# Altium schematic sheet Battery.SchDoc
size A4; Engineer1: Fabian Hernandez; Engineer2: Jason Kim; Engineer3: Amirtha Chandrasekaran; Engineer4: Kevin Thai; Organization: My Company; Address1: Address Line 1; Address2: Address Line 2; Address3: Address Line 3; Address4: Address Line 4; SheetNumber: 2; SheetTotal: 3
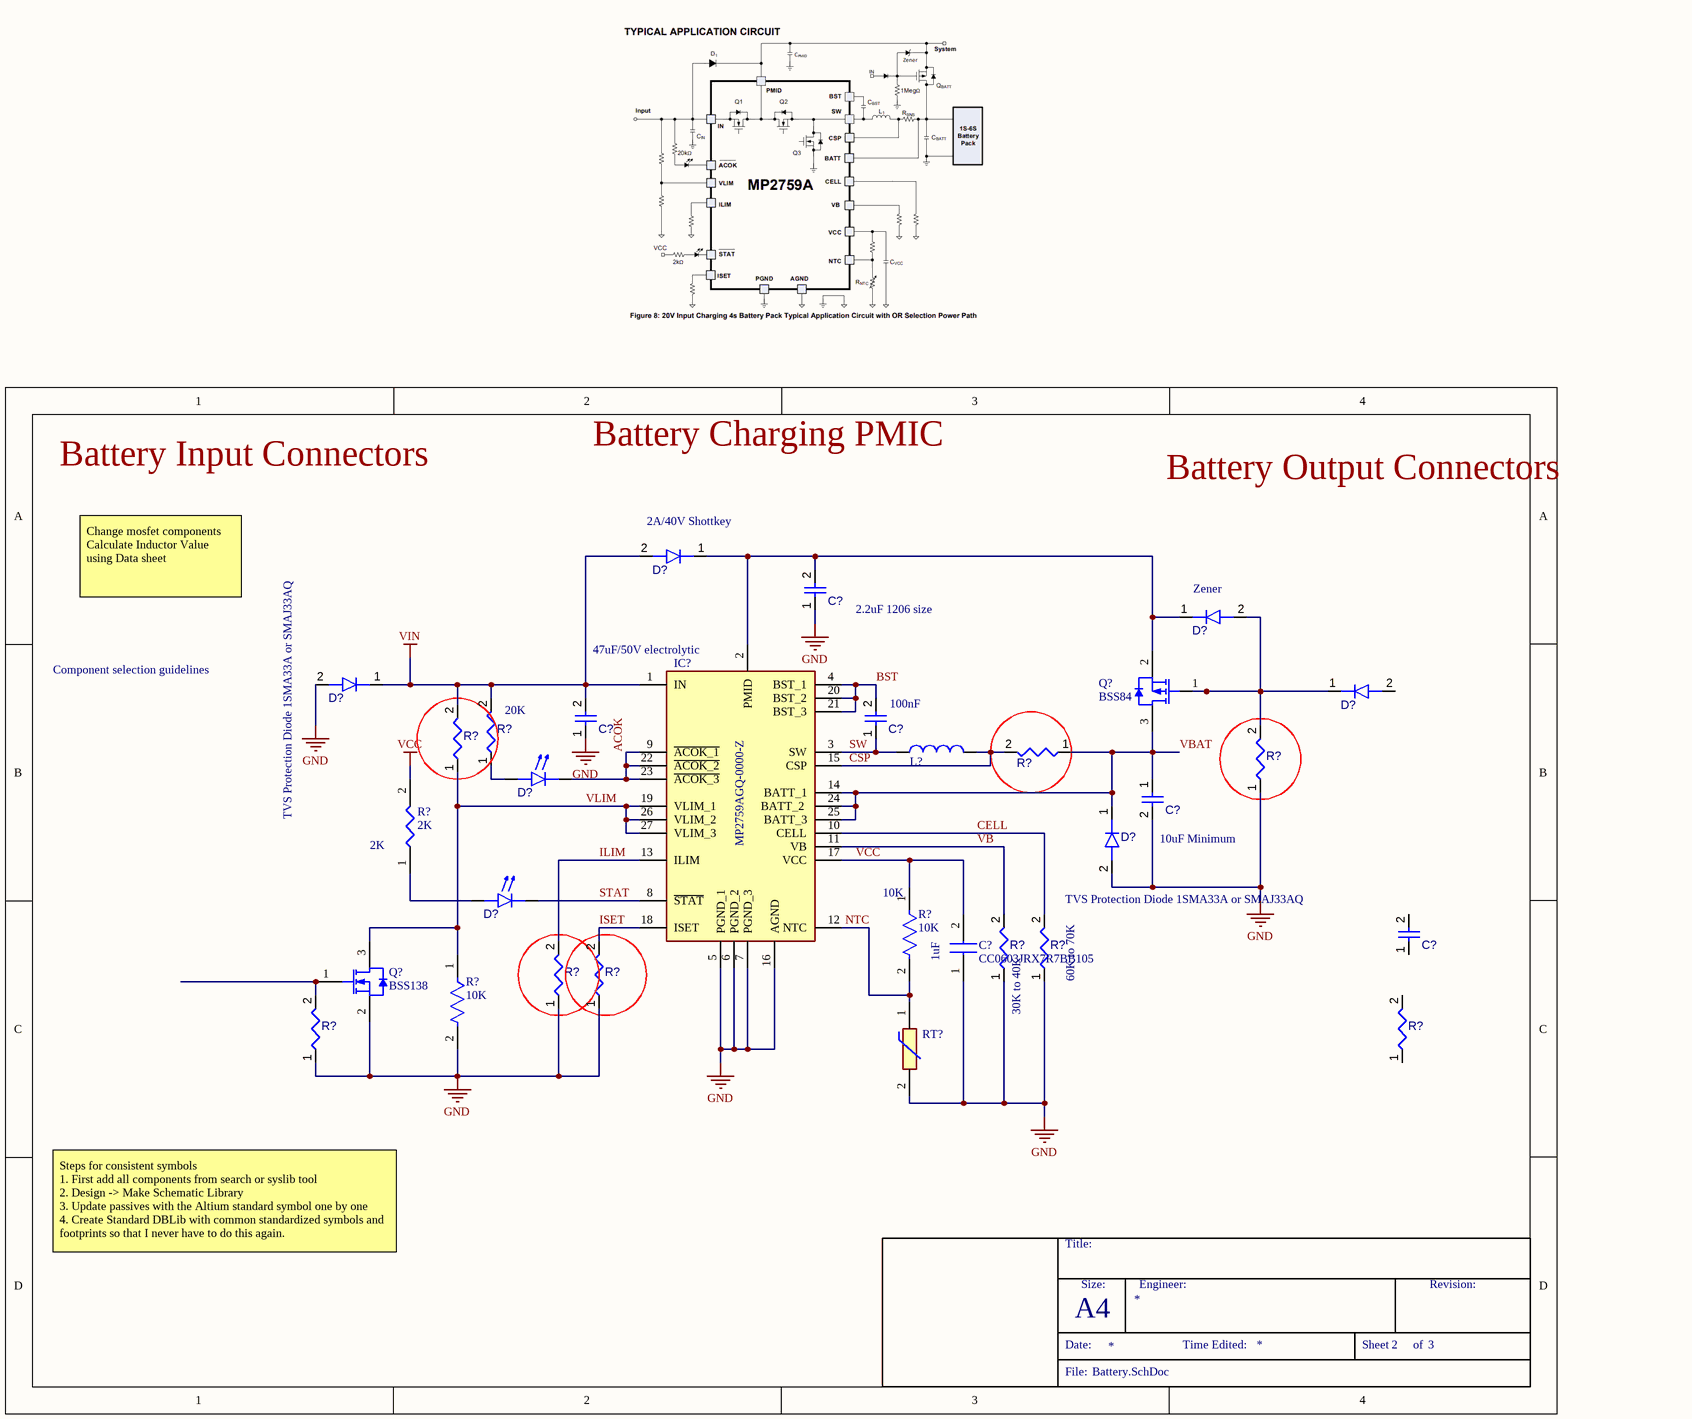
[diagram p0: Battery.SchDoc]

## Parts
(Parts that share a designator on the sheet are numbered #1, #2 ... from top to bottom, then left to right.)
C?#1  Capacitors  (value not drawn)
C?#2  Capacitors  (value not drawn)
C?#3  Capacitors  (value not drawn)
C?#4  Capacitors  (value not drawn)
C?#5  Capacitors  (value not drawn)
C?#6  CC0603JRX7R7BB105  [CAPC1608X90N]
D?#1  Diodes  (value not drawn)
D?#2  Diodes  (value not drawn)
D?#3  Diodes  (value not drawn)
D?#4  Diodes  (value not drawn)
D?#5  LED  (value not drawn)
D?#6  Diodes  (value not drawn)
D?#7  LED  (value not drawn)
IC?  MP2759AGQ-0000-Z  [MP2759GQ0000P]
L?  Inductors  (value not drawn)
Q?#1  BSS84  [FAIR-SOT23-3_V]
Q?#2  BSS138  [FAIR-SOT23-3_V]
R?#1  Resistors  (value not drawn)
R?#2  Resistors  (value not drawn)
R?#3  Resistors  (value not drawn)
R?#4  Resistors  (value not drawn)
R?#5  2K  [RESC5025X70N]
R?#6  10K  [FP-CRGCQ2010-IPC_C]
R?#7  10K  [FP-CRGCQ2010-IPC_C]
R?#8  Resistors  (value not drawn)
R?#9  Resistors  (value not drawn)
R?#10  Resistors  (value not drawn)
R?#11  Resistors  (value not drawn)
R?#12  Resistors  (value not drawn)
R?#13  Resistors  (value not drawn)
RT?  NTCS0805E3103FLT  [THRMC2012X95N]  (value not drawn)

## Nets
GND: C?#1.1 C?#2.1 C?#4.2 C?#6.1 D?#3.2(A) D?#6.2(A) IC?.5(PGND_1) IC?.6(PGND_2) IC?.7(PGND_3) IC?.16(AGND) Q?#2.2(S) R?#4.1 R?#7.2 R?#8.1 R?#9.1 R?#10.1 R?#11.1 R?#12.1 RT?.2
VCC: C?#6.2 IC?.17(VCC) R?#5.2 R?#6.1
VIN: C?#2.2 D?#1.2(A) D?#3.1(K) IC?.1(IN) R?#2.2 R?#3.2
ACOK: D?#5.1(K) IC?.9(~{ACOK_1}) IC?.22(~{ACOK_2}) IC?.23(~{ACOK_3})
BST: C?#3.2 IC?.4(BST_1) IC?.20(BST_2) IC?.21(BST_3)
CELL: IC?.10(CELL) R?#9.2
CSP: IC?.15(CSP) L?.2 R?#1.2
ILIM: IC?.13(ILIM) R?#10.2
ISET: IC?.18(ISET) R?#11.2
NTC: IC?.12(NTC) R?#6.2 RT?.1
STAT: D?#7.1(K) IC?.8(~{STAT})
SW: C?#3.1 IC?.3(SW) L?.1
VB: IC?.11(VB) R?#8.2
VBAT: C?#4.1 D?#6.1(K) IC?.14(BATT_1) IC?.24(BATT_2) IC?.25(BATT_3) Q?#1.3(DRAIN) R?#1.1
VLIM: IC?.19(VLIM_1) IC?.26(VLIM_2) IC?.27(VLIM_3) Q?#2.3(D) R?#3.1 R?#7.1
NetC?#1_2: C?#1.2 D?#1.1(K) D?#2.1(K) IC?.2(PMID) Q?#1.2(SOURCE)
NetD?#2_2: D?#2.2(A) D?#4.1(K) Q?#1.1(GATE) R?#4.2
NetD?#5_2: D?#5.2(A) R?#2.1
NetD?#7_2: D?#7.2(A) R?#5.1
NetQ?#2_1: Q?#2.1(G) R?#12.2

Not connected (* = marked no-connect by the designer): C?#5 1 2; D?#4 2(A); R?#13 1 2

## Notes on the sheet
- Battery Input Connectors
- Battery Charging PMIC
- Battery Output Connectors
- (near D?#1) 2A/40V Shottkey
- Change mosfet components
  Calculate Inductor Value using Data sheet
- (near C?#1) 2.2uF 1206 size
- (near D?#2) Zener
- Component selection guidelines
- (near IC?) 47uF/50V electrolytic
- (near R?#2) 20K
- (near C?#3) 100nF
- (near D?#3) TVS Protection Diode 1SMA33A or SMAJ33AQ
- (near R?#5) 2K
- (near R?#6) 10K
- TVS Protection Diode 1SMA33A or SMAJ33AQ
- (near C?#4) 10uF Minimum
- 1uF
- (near R?#8) 30K to 40K
- (near R?#9) 60K to 70K
- Steps for consistent symbols
  1. First add all components from search or syslib tool
  2. Design -> Make Schematic Library
  3. Update passives with the Altium standard symbol one by one
  4. Create Standard DBLib with common standardized symbols and footprints so that I never have to do this again.
- Title:
- Size:
- Engineer:
- Revision:
- Date:
- A4
- Time Edited:
- Sheet
- of
- File:

## Library data of the parts
C?#1-C?#5 = Capacitors: Capacitor; Component Type: Capacitors
C?#6 = CC0603JRX7R7BB105: Capacitor; Manufacturer_Name: KEMET; Datasheet Link: https://datasheet.datasheetarchive.com/originals/distributors/Datasheets_SAMA/d9f127a4875522309d99aa7dec79633c.pdf; Height: 0.9mm; Manufacturer_Part_Number: CC0603JRX7R7BB105; Mouser Part Number: 603-CC0603JRX77BB105; Mouser Price/Stock: https://www.mouser.com/Search/Refine.aspx?Keyword=603-CC0603JRX77BB105; Arrow Part Number: CC0603JRX7R7BB105; Arrow Price/Stock: https://www.arrow.com/en/products/cc0603jrx7r7bb105/yageo
D?#1-D?#4 D?#6 = Diodes: Diode; Component Type: Diodes
D?#5 D?#7 = LED: Light-emitting Diode; Component Type: LED
IC? = MP2759AGQ-0000-Z: Integrated Circuit; Manufacturer_Name: Monolithic Power Systems (MPS); Datasheet Link: https://www.mouser.com/datasheet/2/277/MP2759AGQ-2888162.pdf; Height: 1mm; Manufacturer_Part_Number: MP2759AGQ-0000-Z; Mouser Part Number: 946-MP2759AGQ-0000-Z; Mouser Price/Stock: https://www.mouser.co.uk/ProductDetail/Monolithic-Power-Systems-MPS/MP2759AGQ-0000-Z?qs=Rp5uXu7WBW%2F6%252BI1hHvcUXg%3D%3D
Q?#1 = CMP-013-00022-4: P-Channel Enhancement Mode Field-Effect Transistor, 0.13 A, 50 V, -55 to 150 degC, 3-Pin SOT23, RoHS, Tape and Reel; Manufacturer: Fairchild; Nominal Vgs: -1.7V; Typical Rise Time: 6.3ns; Input Capacitance: 73pF; Rds On Max: 10Ohm; Elements: 1; Package Version: Rev. 12, 03/2016; Nominal Dual Supply Voltage: -50V; Power: 360mW; Package Quantity: 3000; Mounting Technology: SM; Package Reference: SOT23-3; Case/Package: TO-236-3; Package Description: 3-Pin Small Outline Transistor, Body 2.92 x 1.325 mm, Pitch 0.95 mm; Datasheet URL: https://www.fairchildsemi.com/datasheets/BS/BSS84.pdf; Packaging: TapeandReel; Max Operating Temperature: 150°C; Min Operating Temperature: -55°C; Pins: 3; Datasheet Version: Rev. 1.1.0, 02/2013; RoHS Compliant: True
Q?#2 = CMP-013-00021-4: N-Channel Logic Level Enhancement Mode Field Effect Transistor, 220 mA, 50 V, -55 to 150 degC, 3-Pin SOT-23, RoHS, Tape and Reel; Manufacturer: Fairchild; Elements: 1; Nominal Vgs: 1.3V; Resistance: 0.7Ohm; Typical Rise Time: 9ns; Rds On Max: 3.5Ohm; Nominal Dual Supply Voltage: 50V; Input Capacitance: 27pF; Package Version: Rev. 12, 03/2016; Power: 360mW; Packaging: TapeandReel; Package Description: 3-Pin Small Outline Transistor, Body 2.92 x 1.325 mm, Pitch 0.95 mm; Datasheet URL: https://www.fairchildsemi.com/datasheets/BS/BSS138.pdf; Min Operating Temperature: -55°C; Pins: 3; RoHS Compliant: True; Package Reference: SOT23-3; Package Quantity: 1; Case/Package: TO-236-3; Mounting Technology: SM; Max Operating Temperature: 150°C; Datasheet Version: Rev. C, 10/2005
R?#1-R?#4 R?#8-R?#13 = Resistors: Resistor; Component Type: Resistors
R?#5 = CRCW20102K00FKEFHP: Resistor CRCW20102K00FKEFHP; Manufacturer_Name: Vishay; Datasheet Link: http://www.vishay.com/docs/20043/crcwhpe3.pdf; Height: 0.7mm; Manufacturer_Part_Number: CRCW20102K00FKEFHP; Mouser Part Number: 71-CRCW20102K00FKEFH; Mouser Price/Stock: https://www.mouser.co.uk/ProductDetail/Vishay-Dale/CRCW20102K00FKEFHP?qs=k2%2FDWSARqgHGhBn8H3HYDw%3D%3D; Arrow Part Number: CRCW20102K00FKEFHP; Arrow Price/Stock: https://www.arrow.com/en/products/crcw20102k00fkefhp/vishay
R?#6 R?#7 = CMP-03211-005335-1: CRGCQ2010 10KΩ 0.75W ±100ppm/°C 1% 200V; Manufacturer: TE Connectivity; Manufacturer Part Number: CRGCQ2010F10K; Automotive Grade: Grade 0; Tolerance: 0.01; Temperature Coefficient: ±100ppm/°C; Value: 10KΩ; Octopart: https://octopart.com/crgcq2010f10k-te+connectivity-91018452; Automotive: Yes; Temperature Range Low: -55°C; Resistance: 10KΩ; Height: 0.65mm; Lead Free: Yes; Category: Res; Temperature: -55°C to +155°C; Composition: Thick Film; ComponentLink2Description: Datasheet; Temperature Range High: +155°C; Device Class L3: Chip SMD Resistors; Voltage Rating: 200V; Package: CRGCQ2010; Device Class L2: Resistors; RoHS: TRUE; Series: CRGCQ; ComponentLink2URL: https://www.te.com/commerce/DocumentDelivery/DDEController?Action=showdoc&DocId=Data+Sheet%7F1773204-3%7F1%7Fpdf%7FEnglish%7FENG_DS_1773204-3_1.pdf%7F4-2176347-922; Ambient Temperature Range High: +70°C; Device Class L1: Passive Components; Power Rating: 0.75W; Ipc Land Pattern Name: RESC500250X55
RT? = NTCS0805E3103FLT: Thermistor; Manufacturer_Name: Vishay; Datasheet Link: http://www.vishay.com/docs/29044/ntcs0805e3t.pdf; Height: 0.95mm; Manufacturer_Part_Number: NTCS0805E3103FLT; Mouser Part Number: 594-NTCS0805E3103FLT; Mouser Price/Stock: https://www.mouser.co.uk/ProductDetail/Vishay-BC-Components/NTCS0805E3103FLT?qs=%2FWiulJ9oly4Pd4lidS66Yw%3D%3D; Arrow Part Number: NTCS0805E3103FLT; Arrow Price/Stock: https://www.arrow.com/en/products/ntcs0805e3103flt/vishay
L? = Inductors: Component Type: Inductors